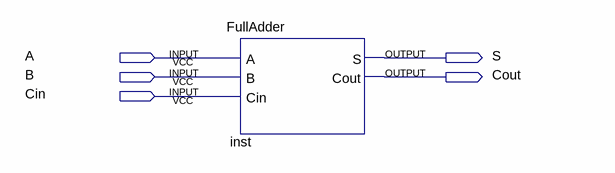
[diagram p0: schematic sheet]
// Quartus schematic FullAdder_BlockDiagram_Parte2.bdf as structural Verilog: 1 symbols, 5 pins
module FullAdder_BlockDiagram_Parte2 (
  input  A,
  input  B,
  input  Cin,
  output S,
  output Cout
);

  FullAdder inst (.A(A), .B(B), .Cin(Cin), .S(S), .Cout(Cout));
endmodule
